# Altium schematic sheet small_parts.SchDoc
size A4; SheetNumber: 1; SheetTotal: 1
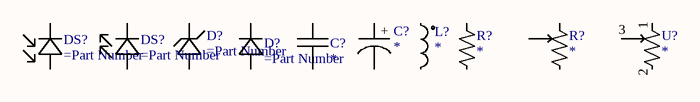
[diagram p0: small_parts.SchDoc]

## Parts
(Parts that share a designator on the sheet are numbered #1, #2 ... from top to bottom, then left to right.)
C?#1  *
C?#2  *
D?#1  (no value)
D?#2  (no value)
DS?#1  (no value)
DS?#2  (no value)
L?  *
R?#1  *
R?#2  *
U?  *

## Nets

Not connected (* = marked no-connect by the designer): C?#1 1 2; C?#2 1 2; D?#1 1(A) 2(K); D?#2 1(A) 2(K); DS?#1 1(A) 2(K); DS?#2 1(A) 2(K); L? 1 2; R?#1 1 2; R?#2 1 2 3(out); U? 1 2 3(out)

## Notes on the sheet
- (in symbol cap_p) +

## Library data of the parts
C?#1 = cap_np: Capacitance: *; Voltage: *; Tolerance: *; Manufacturer Part Number: *; Manufacturer: *
C?#2 = cap_p: Capacitance: *; Voltage: *; Tolerance: *; Manufacturer Part Number: *; Manufacturer: *
D?#1 = zener: Voltage: *; Manufacturer Part Number: *; Manufacturer: *
D?#2 = diode: Voltage: *; Manufacturer Part Number: *; Manufacturer: *
DS?#1 = photodiode: Manufacturer Part Number: *; Manufacturer: *
DS?#2 = LED: Manufacturer Part Number: *; Manufacturer: *
L? = ind: Tolerance: *; Manufacturer Part Number: *; Manufacturer: *; Inductance: *
R?#1 = res_us: Tolerance: *; Manufacturer Part Number: *; Manufacturer: *; Resistance: *
R?#2 = res_us_adj: Tolerance: *; Manufacturer Part Number: *; Manufacturer: *; Resistance: *
U? = res_us_digipot: Tolerance: *; Manufacturer Part Number: *; Manufacturer: *; Resistance: *